# Altium schematic sheet 555 Monostable Multivibrator.schdoc: 555 Monostable Multivibrator
size A4; Organization: Altium Limited; Address1: L3, 12a Rodborough Rd; Address2: Frenchs Forest; Address3: NSW; Address4: Australia 2086; DocumentNumber: 1; SheetNumber: 1; SheetTotal: 1
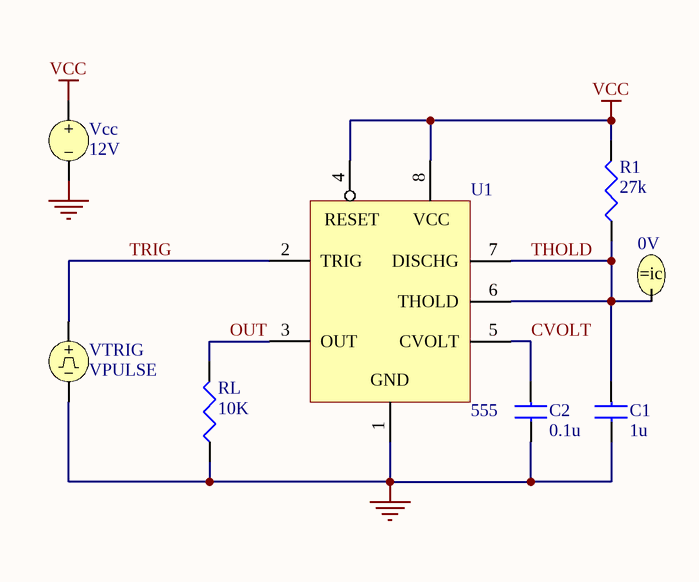
[diagram p0: 555 Monostable Multivibrator.schdoc]

## Parts
C1  1u
C2  0.1u
IC1  0V
R1  27k
RL  10K
U1  555
Vcc  12V
VTRIG  VPULSE

## Nets
GND: C1.2 C2.2 RL.2(BOT) U1.1(GND) Vcc.2 VTRIG.2
VCC: R1.1(TOP) U1.4(RESET) U1.8(VCC) Vcc.1
CVOLT: C2.1 U1.5(CVOLT)
OUT: RL.1(TOP) U1.3(OUT)
THOLD: C1.1 IC1.1 R1.2(BOT) U1.6(THOLD) U1.7(DISCHG)
TRIG: U1.2(TRIG) VTRIG.1

## Notes on the sheet
- Title
- Size:
- Date:
- A4
- Number:
- Time:
- Revision:
- Sheet
- of
- File:

## Library data of the parts
C1 C2 = CAP: Capacitor
  C1: Value: 1u
  C2: Value: 0.1u
IC1 = .IC: Initial Condition; Initial Voltage: 0V
R1 RL = RES: Resistor
  R1: Value: 27k
  RL: Value: 10K
U1 = 555: Timer
Vcc = VSRC: Voltage Source; Value: 12V
VTRIG = VPULSE: Pulse Voltage Source